# Altium schematic sheet 16 MIPI DSI TX.SchDoc: CM4 IO
size 420 x 297 mm; Page Create Date: March  8, 1995; Page Number: 16; Page Size: A3; Comment: radxa_1010; Page Count: 19; RevCode: V1.10; Doc: 16 MIPI DSI TX; DsnPath: D:\WMS\黄工\[RC126]CM4_IO_V1.10\[RC126]_V1.10\CM4 IO_V1.10.DSN; SchematicName: CM4 IO V1.10; PageName: 16 MIPI DSI TX; PageSize: A3; TopSchematic: True
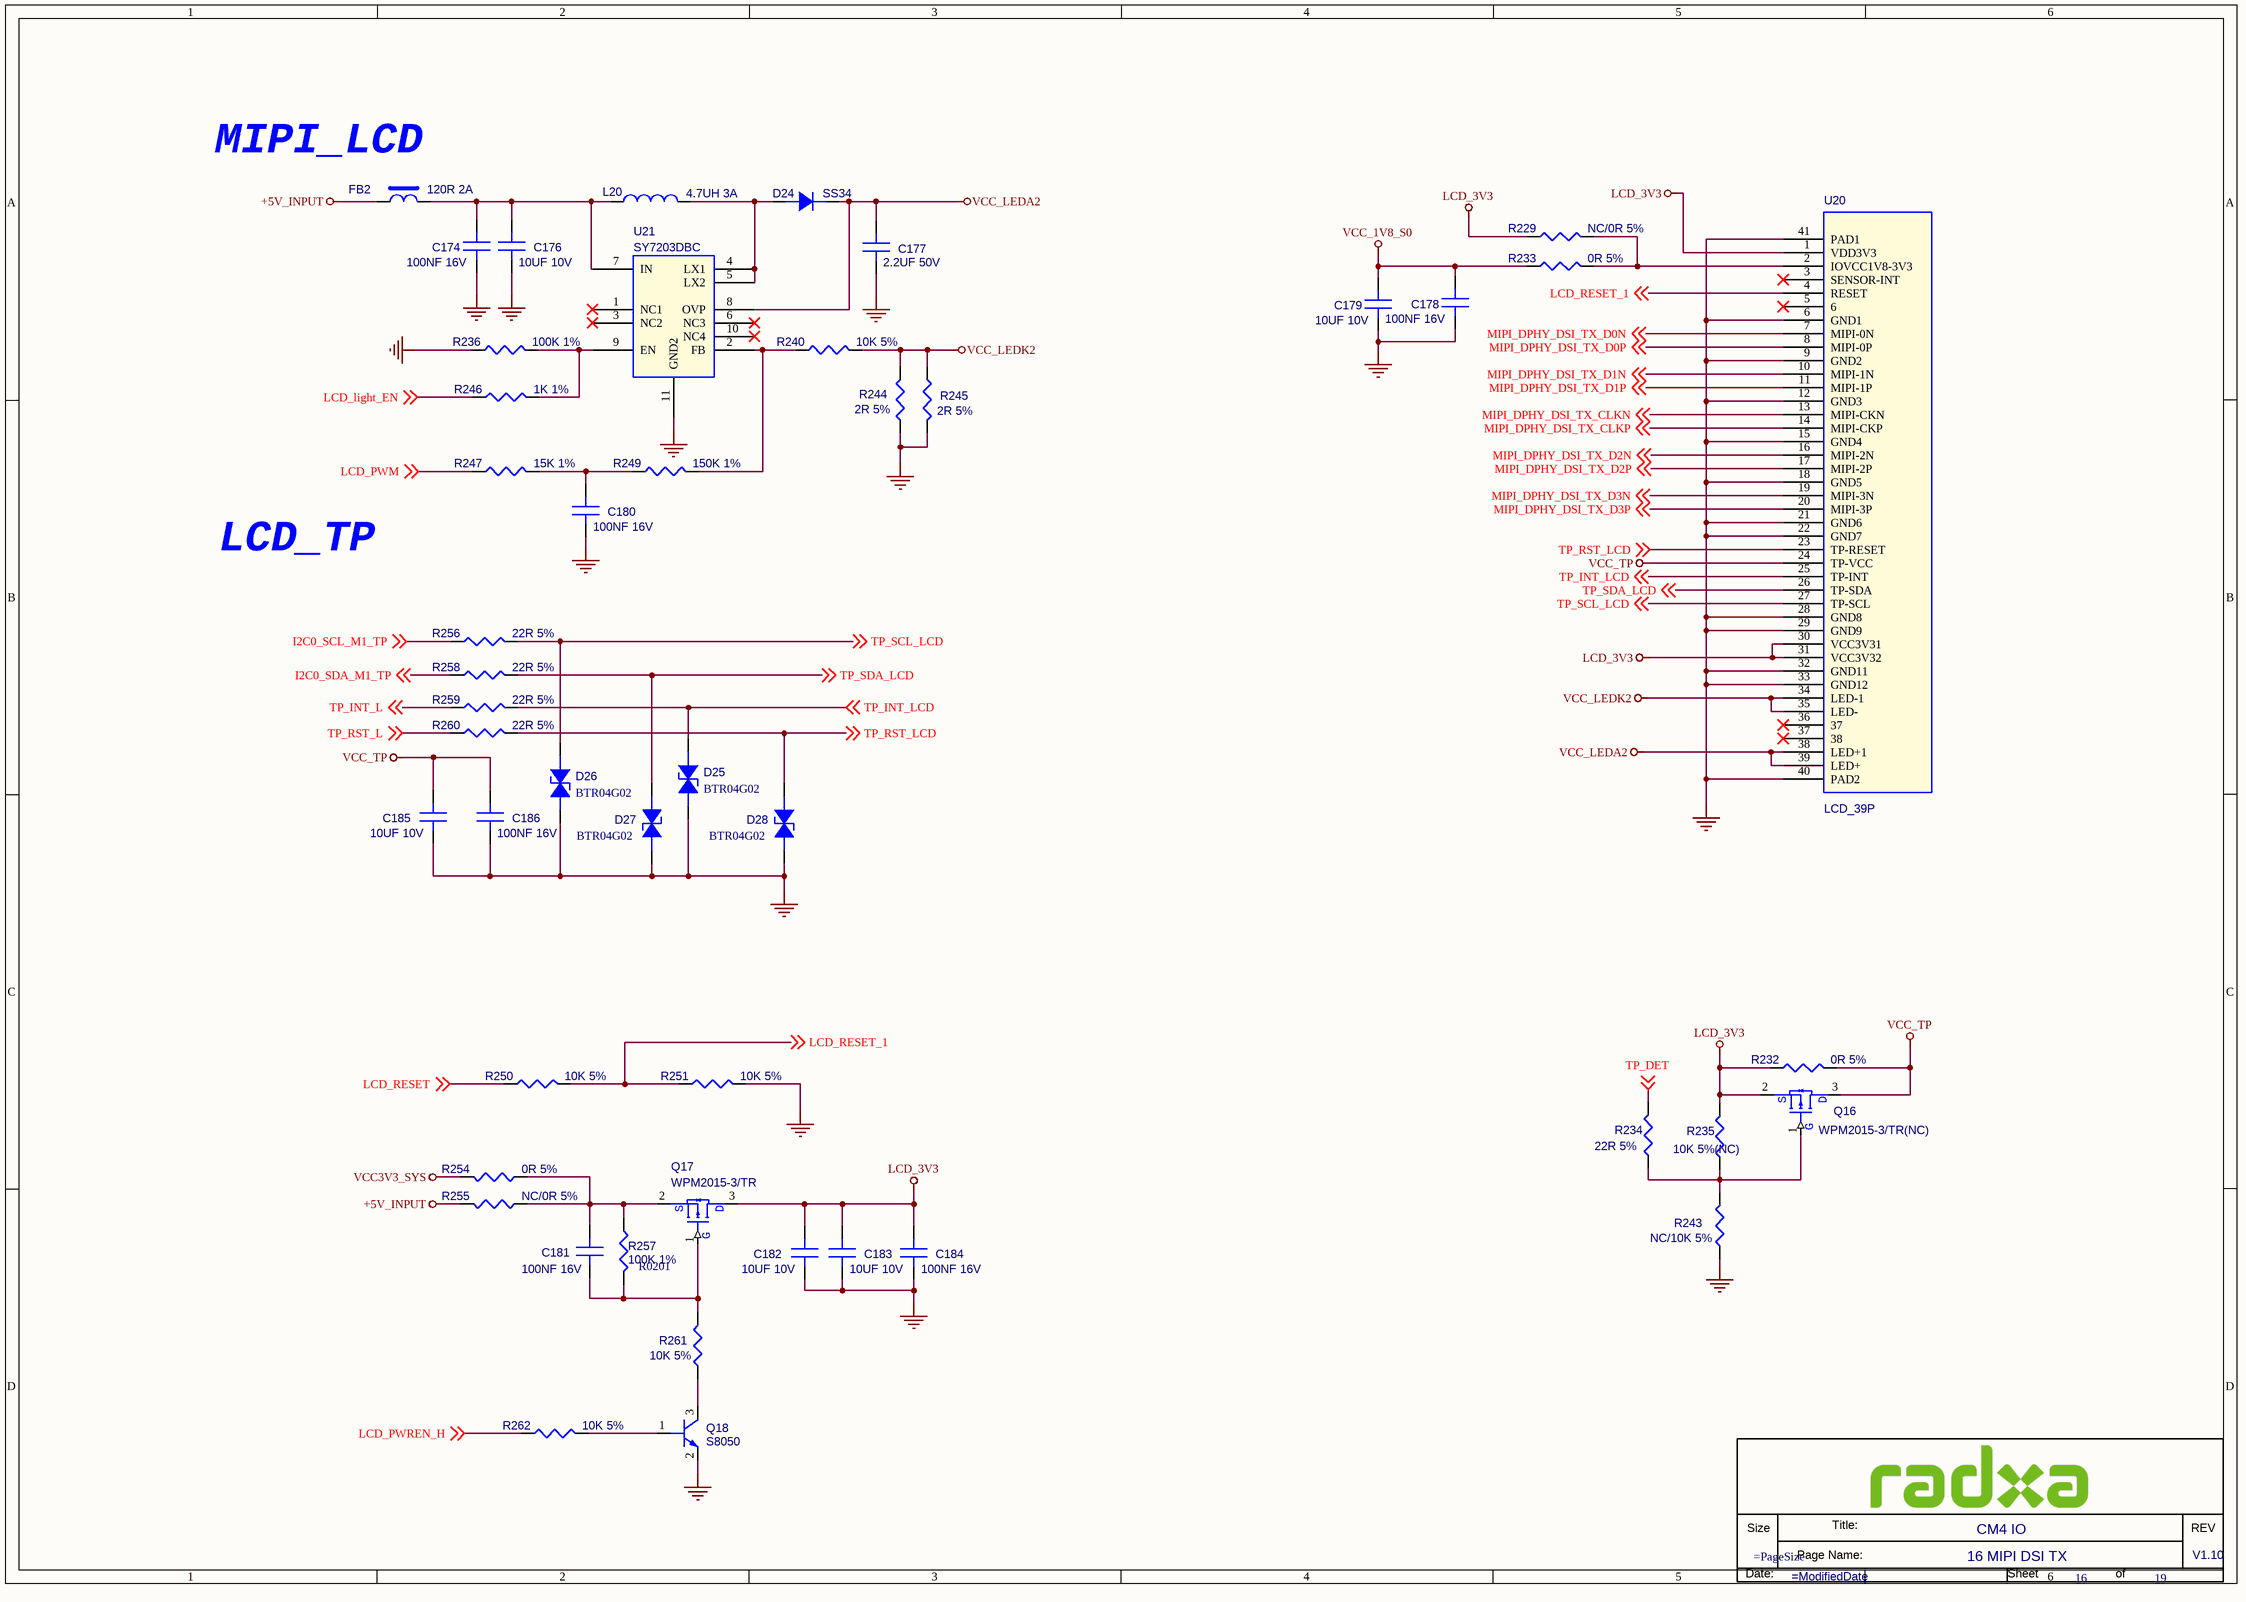
[diagram p0: 16 MIPI DSI TX.SchDoc]

## Parts
*  Doc: 16 MIPI DSI TX  RevCode: V1.10  Title: CM4 IO  Page Number: 16  Page Count: 19  (hidden comment: radxa_1010)  (graphical)
C174  100NF 16V  [C0201]
C176  10UF 10V  [C0603]
C177  2.2UF 50V  [C0603]
C178  100NF 16V  [C0201]
C179  10UF 10V  [C0603]
C180  100NF 16V  [C0201]
C181  100NF 16V  [C0201]
C182  10UF 10V  [C0603]
C183  10UF 10V  [C0603]
C184  100NF 16V  [C0201]
C185  10UF 10V  [C0603]
C186  100NF 16V  [C0201]
D24  SS34  [DO_214AC]
D25  BTR04G02  [DFN1006-2L]
D26  BTR04G02  [DFN1006-2L]
D27  BTR04G02  [DFN1006-2L]
D28  BTR04G02  [DFN1006-2L]
FB2  120R 2A  [FB0603]
L20  4.7UH 3A  [L_3015]
Q16  WPM2015-3/TR(NC)  [SOT_23]
Q17  WPM2015-3/TR  [SOT_23]
Q18  S8050  [SOT_23]
R229  NC/0R 5%  [R0402]
R232  0R 5%  [R0402]
R233  0R 5%  [R0402]
R234  22R 5%  [R0402]
R235  10K 5%(NC)  [R0402]
R236  100K 1%  [R0402]
R240  10K 5%  [R0402]
R243  NC/10K 5%  [R0402]
R244  2R 5%  [R0402]
R245  2R 5%  [R0402]
R246  1K 1%  [R0402]
R247  15K 1%  [R0402]
R249  150K 1%  [R0402]
R250  10K 5%  [R0402]
R251  10K 5%  [R0402]
R254  0R 5%  [R0402]
R255  NC/0R 5%  [R0402]
R256  22R 5%  [R0402]
R257  100K 1%  PCB Footprint: R0201  [R0402]
R258  22R 5%  [R0402]
R259  22R 5%  [R0402]
R260  22R 5%  [R0402]
R261  10K 5%  [R0402]
R262  10K 5%  [R0402]
U20  LCD_39P  [FPC_39P_0D3_LIE]
U21  SY7203DBC  [DFN10_0D5_3]

## Nets
+5V_INPUT: FB2.1 R255.1
GND: C174.2(B) C176.2(B) C177.2(B) C178.2(B) C179.2(B) C180.1(A) C182.2(B) C183.2(B) C184.2(B) C185.2(B) C186.2(B) D25.2(CATHODE) D26.2(CATHODE) D27.2(CATHODE) D28.2(CATHODE) Q18.2(EMITTER) R236.1 R243.1 R244.2 R245.2 R251.2 U20.6(GND1) U20.9(GND2) U20.12(GND3) U20.15(GND4) U20.18(GND5) U20.21(GND6) U20.22(GND7) U20.28(GND8) U20.29(GND9) U20.32(GND11) U20.33(GND12) U20.40(PAD2) U20.41(PAD1) U21.11(GND2)
LCD_3V3: C182.1(A) C183.1(A) C184.1(A) Q16.2(S) Q17.3(D) R229.1 R232.1 R235.2 U20.1(VDD3V3) U20.30(VCC3V31) U20.31(VCC3V32)
VCC3V3_SYS: R254.1
VCC_1V8_S0: C178.1(A) C179.1(A) R233.1
VCC_LEDA2: C177.1(A) D24.2(K) U20.38(LED+1) U20.39(LED+) U21.8(OVP)
VCC_LEDK2: R240.2 R244.1 R245.1 U20.34(LED-1) U20.35(LED-)
VCC_TP: C185.1(A) C186.1(A) Q16.3(D) R232.2 U20.24(TP-VCC)
I2C0_SCL_M1_TP: R256.1 ; off-sheet I2C0_SCL_M1_TP
I2C0_SDA_M1_TP: R258.1 ; off-sheet I2C0_SDA_M1_TP
LCD_light_EN: R246.1 ; off-sheet LCD_light_EN
LCD_PWM: R247.1 ; off-sheet LCD_PWM
LCD_PWREN_H: R262.1 ; off-sheet LCD_PWREN_H
LCD_RESET: R250.1 ; off-sheet LCD_RESET
LCD_RESET_1: R250.2 R251.1 U20.4(RESET) ; off-sheet LCD_RESET_1
MIPI_DPHY_DSI_TX_CLKN: U20.13(MIPI-CKN) ; off-sheet MIPI_DPHY_DSI_TX_CLKN
MIPI_DPHY_DSI_TX_CLKP: U20.14(MIPI-CKP) ; off-sheet MIPI_DPHY_DSI_TX_CLKP
MIPI_DPHY_DSI_TX_D0N: U20.7(MIPI-0N) ; off-sheet MIPI_DPHY_DSI_TX_D0N
MIPI_DPHY_DSI_TX_D0P: U20.8(MIPI-0P) ; off-sheet MIPI_DPHY_DSI_TX_D0P
MIPI_DPHY_DSI_TX_D1N: U20.10(MIPI-1N) ; off-sheet MIPI_DPHY_DSI_TX_D1N
MIPI_DPHY_DSI_TX_D1P: U20.11(MIPI-1P) ; off-sheet MIPI_DPHY_DSI_TX_D1P
MIPI_DPHY_DSI_TX_D2N: U20.16(MIPI-2N) ; off-sheet MIPI_DPHY_DSI_TX_D2N
MIPI_DPHY_DSI_TX_D2P: U20.17(MIPI-2P) ; off-sheet MIPI_DPHY_DSI_TX_D2P
MIPI_DPHY_DSI_TX_D3N: U20.19(MIPI-3N) ; off-sheet MIPI_DPHY_DSI_TX_D3N
MIPI_DPHY_DSI_TX_D3P: U20.20(MIPI-3P) ; off-sheet MIPI_DPHY_DSI_TX_D3P
TP_DET: R234.1 ; off-sheet TP_DET
TP_INT_L: R259.1 ; off-sheet TP_INT_L
TP_INT_LCD: D25.1(ANODE) R259.2 U20.25(TP-INT) ; off-sheet TP_INT_LCD
TP_RST_L: R260.1 ; off-sheet TP_RST_L
TP_RST_LCD: D28.1(ANODE) R260.2 U20.23(TP-RESET) ; off-sheet TP_RST_LCD
TP_SCL_LCD: D26.1(ANODE) R256.2 U20.27(TP-SCL) ; off-sheet TP_SCL_LCD
TP_SDA_LCD: D27.1(ANODE) R258.2 U20.26(TP-SDA) ; off-sheet TP_SDA_LCD
NetC174_1: C174.1(A) C176.1(A) FB2.2 L20.1 U21.7(IN)
NetC180_2: C180.2(B) R247.2 R249.1
NetC181_1: C181.1(A) Q17.2(S) R254.2 R255.2 R257.1
NetC181_2: C181.2(B) Q17.1(G) R257.2 R261.1
NetD24_1: D24.1(A) L20.2 U21.4(LX1) U21.5(LX2)
NetQ16_1: Q16.1(G) R234.2 R235.1 R243.2
NetQ18_1: Q18.1(BASE) R262.2
NetQ18_3: Q18.3(COLLECTOR) R261.2
NetR229_2: R229.2 R233.2 U20.2(IOVCC1V8-3V3)
NetR236_2: R236.2 R246.2 U21.9(EN)
NetR240_1: R240.1 R249.2 U21.2(FB)

Not connected (* = marked no-connect by the designer): U20 3(SENSOR-INT)* 5(6)* 36(37)* 37(38)*; U21 1(NC1)* 3(NC2)* 6(NC3)* 10(NC4)*

## Notes on the sheet
- (near FB2) MIPI_LCD
- LCD_TP
- (in symbol radxa_1010) Size; Title:; REV; Page Name:; Date:; Sheet; of

## Library data of the parts
C174 = C: SMD  0201  100NF  16V  X5R  ±20%  ROHS; PARTS: 1; Part Reference: C174; Part Number: A1C01.00099; OriginalSymbolOrigin: (0,30); PKG_TYPE: CAP2-100-250; LEVEL: STD; PINSWAP: (A,B); Preferred: 6715f349cd0bc5; Value: 100NF 16V; Part Type: 陶瓷电容
C176 = C: SMD  0603  10UF  10V  X5R  ±10%  ROHS; PARTS: 1; Part Reference: C176; Part Number: A1C01.00270; OriginalSymbolOrigin: (0,30); PKG_TYPE: CAP2-100-250; LEVEL: STD; PINSWAP: (A,B); Value: 10UF 10V; PCB Footprint: C0603; Part Type: 陶瓷电容
C177 = C: SMD  0603  2.2UF  50V  X5R  ±10%  ROHS; PARTS: 1; Part Reference: C177; Part Number: A1C01.00235; OriginalSymbolOrigin: (0,30); PKG_TYPE: CAP2-100-250; LEVEL: STD; PINSWAP: (A,B); Value: 2.2UF 50V; PCB Footprint: C0603; Part Type: 陶瓷电容
C178 = C: SMD  0201  100NF  16V  X5R  ±20%  ROHS; PARTS: 1; Part Reference: C178; Part Number: A1C01.00099; OriginalSymbolOrigin: (0,30); PKG_TYPE: CAP2-100-250; LEVEL: STD; PINSWAP: (A,B); Preferred: 6715f349cd0bc5; Value: 100NF 16V; Part Type: 陶瓷电容
C179 = C: SMD  0603  10UF  10V  X5R  ±10%  ROHS; PARTS: 1; Part Reference: C179; Part Number: A1C01.00270; OriginalSymbolOrigin: (0,30); PKG_TYPE: CAP2-100-250; LEVEL: STD; PINSWAP: (A,B); Value: 10UF 10V; PCB Footprint: C0603; Part Type: 陶瓷电容
C180 = C: SMD  0201  100NF  16V  X5R  ±20%  ROHS; PARTS: 1; Part Reference: C180; Part Number: A1C01.00099; OriginalSymbolOrigin: (0,30); PKG_TYPE: CAP2-100-250; LEVEL: STD; PINSWAP: (A,B); Preferred: 6715f349cd0bc5; Value: 100NF 16V; Part Type: 陶瓷电容
C181 = C: SMD  0201  100NF  16V  X5R  ±20%  ROHS; PARTS: 1; Part Reference: C181; Part Number: A1C01.00099; OriginalSymbolOrigin: (0,30); PKG_TYPE: CAP2-100-250; LEVEL: STD; PINSWAP: (A,B); Preferred: 6715f349cd0bc5; Value: 100NF 16V; Part Type: 陶瓷电容
C182 = C: SMD  0603  10UF  10V  X5R  ±10%  ROHS; PARTS: 1; Part Reference: C182; Part Number: A1C01.00270; OriginalSymbolOrigin: (0,30); PKG_TYPE: CAP2-100-250; LEVEL: STD; PINSWAP: (A,B); Value: 10UF 10V; PCB Footprint: C0603; Part Type: 陶瓷电容
C183 = C: SMD  0603  10UF  10V  X5R  ±10%  ROHS; PARTS: 1; Part Reference: C183; Part Number: A1C01.00270; OriginalSymbolOrigin: (0,30); PKG_TYPE: CAP2-100-250; LEVEL: STD; PINSWAP: (A,B); Value: 10UF 10V; PCB Footprint: C0603; Part Type: 陶瓷电容
C184 = C: SMD  0201  100NF  16V  X5R  ±20%  ROHS; PARTS: 1; Part Reference: C184; Part Number: A1C01.00099; OriginalSymbolOrigin: (0,30); PKG_TYPE: CAP2-100-250; LEVEL: STD; PINSWAP: (A,B); Preferred: 6715f349cd0bc5; Value: 100NF 16V; Part Type: 陶瓷电容; PCB Footprint: C0201
C185 = C: SMD  0603  10UF  10V  X5R  ±10%  ROHS; PARTS: 1; Part Reference: C185; Part Number: A1C01.00270; OriginalSymbolOrigin: (0,30); PKG_TYPE: CAP2-100-250; LEVEL: STD; PINSWAP: (A,B); Value: 10UF 10V; PCB Footprint: C0603; Part Type: 陶瓷电容
C186 = C: SMD  0201  100NF  16V  X5R  ±20%  ROHS; PARTS: 1; Part Reference: C186; Part Number: A1C01.00099; OriginalSymbolOrigin: (0,30); PKG_TYPE: CAP2-100-250; LEVEL: STD; PINSWAP: (A,B); Preferred: 6715f349cd0bc5; Value: 100NF 16V; Part Type: 陶瓷电容
D24 = DIODE: SMD  编带  DO-214AC  SS34  CJ  ROHS; Part Reference: D24; Part Number: A1D02.00052; Value: SS34; Part Type: 二极管-ESD管-桥堆-TVS管; PCB Footprint: DO_214AC
D25 = ESD: SMD  编带  0402  BTR04G02  B-tron  ROHS; Part Reference: D25; Part Number: A1D02.00002; Parameter: ESD-台舟 ESD5341N-封装 esd0402; ID: DE-E0004; PCB Footprint: ESD_D0402; Temp Coeff: -50℃ ~ +125℃; Value: BTR04G02; Part Type: 二极管-ESD管-桥堆-TVS管
D26 = ESD: SMD  编带  0402  BTR04G02  B-tron  ROHS; Part Reference: D26; Part Number: A1D02.00002; Parameter: ESD-台舟 ESD5341N-封装 esd0402; ID: DE-E0004; PCB Footprint: ESD_D0402; Temp Coeff: -50℃ ~ +125℃; Value: BTR04G02; Part Type: 二极管-ESD管-桥堆-TVS管
D27 = ESD: SMD  编带  0402  BTR04G02  B-tron  ROHS; Part Reference: D27; Part Number: A1D02.00002; Parameter: ESD-台舟 ESD5341N-封装 esd0402; ID: DE-E0004; PCB Footprint: ESD_D0402; Temp Coeff: -50℃ ~ +125℃; Value: BTR04G02; Part Type: 二极管-ESD管-桥堆-TVS管
D28 = ESD: SMD  编带  0402  BTR04G02  B-tron  ROHS; Part Reference: D28; Part Number: A1D02.00002; Parameter: ESD-台舟 ESD5341N-封装 esd0402; ID: DE-E0004; PCB Footprint: ESD_D0402; Temp Coeff: -50℃ ~ +125℃; Value: BTR04G02; Part Type: 二极管-ESD管-桥堆-TVS管
FB2 = BEAD: SMD  0603  FB120R  2A  PZ1608U121-2R0TF  ±25%  Sunlord(顺络)  ROHS; Part Reference: FB2; Part Number: A1L09.00003; Temp Coeff: -55℃~+125℃; PCB Footprint: FB0603; Value: 120R 2A; Part Type: 贴片磁珠
L20 = L: SMD  带屏蔽  3*3*1.5mm  4.7UH  3A  ±20%  RXWHJ3015-4R7MT  ROHS; Part Reference: L20; Part Number: A1L01.00021; PCB Footprint: L_3015; Value: 4.7UH 3A; Part Type: 贴片功率电感
Q16 = MOSFET_PNP: SMD编带  SOT-23  WPM2015-3/TR  P沟道  ROHS; Part Reference: Q16; Part Number: A1D01.00019; Temp Coeff: -55℃ to ＋150℃; Value: WPM2015-3/TR(NC); Part Type: 三极管-MOS管; PCB Footprint: SOT_23
Q17 = MOSFET_PNP: SMD编带  SOT-23  WPM2015-3/TR  P沟道  ROHS; Part Reference: Q17; Part Number: A1D01.00019; Temp Coeff: -55℃ to ＋150℃; Value: WPM2015-3/TR; PCB Footprint: SOT_23; Part Type: 三极管-MOS管
Q18 = NPN: SMD编带  SOT-23  S8050  NPN  ROHS; Part Reference: Q18; Part Number: A1D01.00009; Manufacturer PN: S8050_SOT23; Manufacturer: 长电; Temp Coeff: -55℃ to ＋150℃; Pc: 0.3W; Vceo: 25V; Ic: 0.5A; Priority: A; PCB Footprint: SOT_23; Value: S8050; Created by: JJJ; Part Type: 三极管-MOS管; RK PN: S8050
R229 = R: SMD  0201  0R  1/20W  ±5%  ROHS; Part Reference: R229; Part Number: A1R01.00027; PCB Footprint: R0201; Temp Coeff: －55℃ ~ ＋125℃; Value: NC/0R 5%; Part Type: 贴片电阻
R232 = R: SMD  0201  0R  1/20W  ±5%  ROHS; Part Reference: R232; Part Number: A1R01.00027; PCB Footprint: R0201; Temp Coeff: －55℃ ~ ＋125℃; Value: 0R 5%; Part Type: 贴片电阻
R233 = R: SMD  0201  0R  1/20W  ±5%  ROHS; Part Reference: R233; Part Number: A1R01.00027; PCB Footprint: R0201; Temp Coeff: －55℃ ~ ＋125℃; Value: 0R 5%; Part Type: 贴片电阻
R234 = R: SMD  0201  22R  1/20W  ±5%  ROHS; Part Reference: R234; Part Number: A1R01.00024; PCB Footprint: R0201; Value: 22R 5%; Part Type: 贴片电阻
R235 = R: SMD  0201  10K  1/20W  ±5%  ROHS; Part Reference: R235; Part Number: A1R01.00012; PCB Footprint: R0201; Temp Coeff: －55℃ ~ ＋125℃; Value: 10K 5%(NC); Part Type: 贴片电阻
R236 = R: SMD  0201  100K  1/20W  ±1%  ROHS; Part Reference: R236; Part Number: A1R01.00165; Preferred: 6715f349cd0bc5; Value: 100K 1%; Part Type: 贴片电阻
R240 = R: SMD  0201  10K  1/20W  ±5%  ROHS; Part Reference: R240; Part Number: A1R01.00012; PCB Footprint: R0201; Temp Coeff: －55℃ ~ ＋125℃; Value: 10K 5%; Part Type: 贴片电阻
R243 = R: SMD  0201  10K  1/20W  ±5%  ROHS; Part Reference: R243; Part Number: A1R01.00012; PCB Footprint: R0201; Temp Coeff: －55℃ ~ ＋125℃; Value: NC/10K 5%; Part Type: 贴片电阻
R244 = R: SMD  0603  2R  1/10W  ±5%  ROHS; Part Reference: R244; Part Number: A1R01.00329; PCB Footprint: R0603; Value: 2R 5%; Part Type: 贴片电阻
R245 = R: SMD  0603  2R  1/10W  ±5%  ROHS; Part Reference: R245; Part Number: A1R01.00329; PCB Footprint: R0603; Value: 2R 5%; Part Type: 贴片电阻
R246 = R: SMD  0201  1K  1/20W  ±1%  ROHS; Part Reference: R246; Part Number: A1R01.00111; PCB Footprint: R0201; Value: 1K 1%; Part Type: 贴片电阻
R247 = R: SMD  0201  15K  1/20W  ±1%  ROHS; Part Reference: R247; Part Number: A1R01.00119; PCB Footprint: R0201; Value: 15K 1%; Part Type: 贴片电阻
R249 = R: SMD  0201  150K  1/20W  ±1%  ROHS; Part Reference: R249; Part Number: A1R01.00095; PCB Footprint: R0201; Value: 150K 1%; Part Type: 贴片电阻
R250 = R: SMD  0201  10K  1/20W  ±5%  ROHS; Part Reference: R250; Part Number: A1R01.00012; PCB Footprint: R0201; Temp Coeff: －55℃ ~ ＋125℃; Value: 10K 5%; Part Type: 贴片电阻
R251 = R: SMD  0201  10K  1/20W  ±5%  ROHS; Part Reference: R251; Part Number: A1R01.00012; PCB Footprint: R0201; Temp Coeff: －55℃ ~ ＋125℃; Value: 10K 5%; Part Type: 贴片电阻
R254 = R: SMD  0402  0R  1/16W  ±5%  ROHS; Part Reference: R254; Part Number: A1R01.00030; PCB Footprint: R0402; Value: 0R 5%; Part Type: 贴片电阻
R255 = R: SMD  0201  0R  1/20W  ±5%  ROHS; Part Reference: R255; Part Number: A1R01.00027; PCB Footprint: R0201; Temp Coeff: －55℃ ~ ＋125℃; Value: NC/0R 5%; Part Type: 贴片电阻
R256 = R: SMD  0201  22R  1/20W  ±5%  ROHS; Part Reference: R256; Part Number: A1R01.00024; PCB Footprint: R0201; Value: 22R 5%; Part Type: 贴片电阻
R257 = R: SMD  0201  100K  1/20W  ±1%  ROHS; Part Reference: R257; Part Number: A1R01.00165; Preferred: 6715f349cd0bc5; Value: 100K 1%; Part Type: 贴片电阻
R258 = R: SMD  0201  22R  1/20W  ±5%  ROHS; Part Reference: R258; Part Number: A1R01.00024; PCB Footprint: R0201; Value: 22R 5%; Part Type: 贴片电阻
R259 = R: SMD  0201  22R  1/20W  ±5%  ROHS; Part Reference: R259; Part Number: A1R01.00024; PCB Footprint: R0201; Value: 22R 5%; Part Type: 贴片电阻
R260 = R: SMD  0201  22R  1/20W  ±5%  ROHS; Part Reference: R260; Part Number: A1R01.00024; PCB Footprint: R0201; Value: 22R 5%; Part Type: 贴片电阻
R261 = R: SMD  0201  10K  1/20W  ±5%  ROHS; Part Reference: R261; Part Number: A1R01.00012; PCB Footprint: R0201; Temp Coeff: －55℃ ~ ＋125℃; Value: 10K 5%; Part Type: 贴片电阻
R262 = R: SMD  0201  10K  1/20W  ±5%  ROHS; Part Reference: R262; Part Number: A1R01.00012; PCB Footprint: R0201; Temp Coeff: －55℃ ~ ＋125℃; Value: 10K 5%; Part Type: 贴片电阻
U20 = LCD_39P: SMD  下接触  卧式  39PIN  0.3mm脚距  后翻盖H1.0  FH35C-39S-0.3SHW(50)  镀金  广濑  ROHS; Part Reference: U20; Part Number: A1J06.00001; Value: LCD_39P; PCB Footprint: FPC_39P_0D3_LIE; Part Type: FPC座
U21 = SY7203DBC: SMD  升压  SY7203DBC  DFN3X3-10  silergy(矽力杰)  ROHS; Part Reference: U21; Part Number: A1I01.00260; PCB Footprint: DFN10_0D5_3; Value: SY7203DBC; Part Type: 集成电路/模块
* = radxa_1010: Page Create Date: March  8, 1995; Page Size: =PageSize; Page Modify Date: =ModifiedDate